# Altium schematic sheet HV_Detect.SchDoc
size A
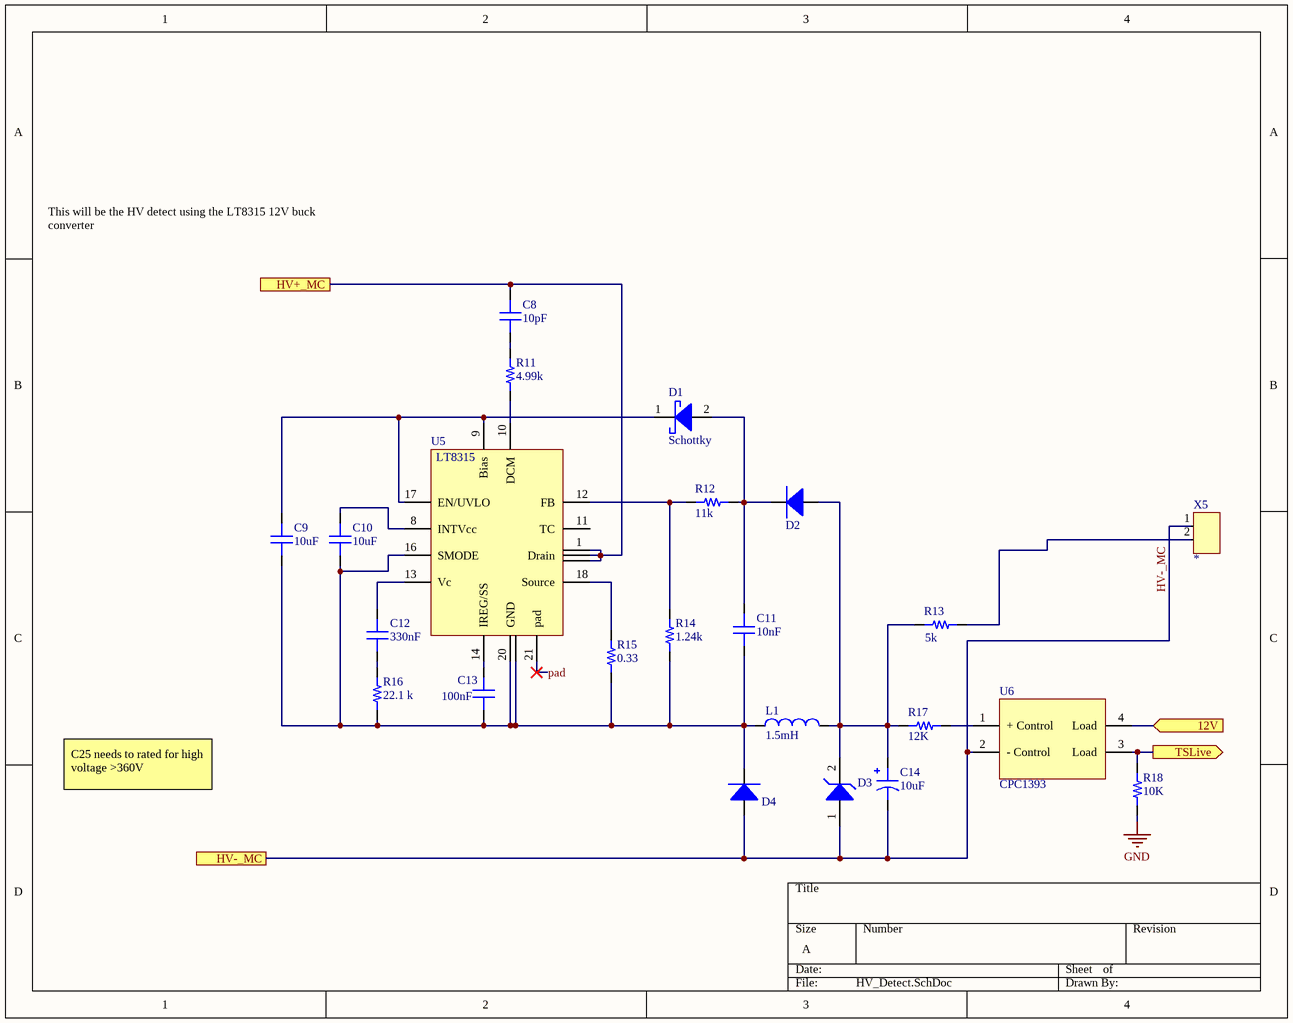
[diagram p0: HV_Detect.SchDoc]

## Parts
C8  capacitance: 10pF  [CAP 0805/2012]
C9  capacitance: 10uF  [0603]  (hidden comment: capacitor)
C10  capacitance: 10uF  [0603]  (hidden comment: capacitor)
C11  capacitance: 10nF  [0603]  (hidden comment: capacitor)
C12  capacitance: 330nF  [0603]  (hidden comment: capacitor)
C13  capacitance: 100nF  [0603]  (hidden comment: capacitor)
C14  capacitance: 10uF  [CMMR1U-06]  (hidden comment: Capacitor_Electrolytic)
D1  Schottky  [SOD323]
D2  diode  [CMMR1U-06]  (value not drawn)
D3  *  [SOD123F]  (value not drawn)
D4  diode  [C3D1P7060Q]  (value not drawn)
L1  1.5mH  [SDR1005]
R11  4.99k  [RES 0603/1608]
R12  11k  [RES 0603/1608]
R13  5k  [RES 0603/1608]
R14  1.24k  [RES 0603/1608]
R15  0.33  [RES 0603/1608]
R16  22.1 k  [RES 0603/1608]
R17  12K  [RES 0603/1608]
R18  10K  [RES 0603/1608]
U5  LT8315  [TSSOP20-Thermal]
U6  CPC1393  [CPC1393GR]
X5  *  [CONN 43650-0200 MOLEX 2PIN]

## Ports
12V (in), HV+_MC, HV-_MC, TSLive (out)

## Nets
GND: R18.1
12V: U6.4(Load) ; port 12V
HV+_MC: C8.2 U5.1(Drain) U5.2(Drain) U5.3(Drain) ; port HV+_MC
HV-_MC: C14.2 D3.1(A) D4.2 U6.2(-_Control) X5.1 ; port HV-_MC
pad: U5.21(pad)
TSLive: R18.2 U6.3(Load) ; port TSLive
NetC8_1: C8.1 R11.1
NetC9_1: C9.1 D1.1(K) U5.9(Bias) U5.17(EN/UVLO)
NetC9_2: C9.2 C10.2 C11.1 C13.1 D4.1 L1.1 R14.1 R15.1 R16.2 U5.15(GND) U5.16(SMODE) U5.20(GND)
NetC10_1: C10.1 U5.8(INTVcc)
NetC11_2: C11.2 D1.2(A) D2.1 R12.2
NetC12_1: C12.1 R16.1
NetC12_2: C12.2 U5.13(Vc)
NetC13_2: C13.2 U5.14(IREG/SS)
NetC14_1: C14.1 D2.2 D3.2(K) L1.2 R13.1 R17.1
NetR11_2: R11.2 U5.10(DCM)
NetR12_1: R12.1 R14.2 U5.12(FB)
NetR13_2: R13.2 X5.2
NetR15_2: R15.2 U5.18(Source)
NetR17_2: R17.2 U6.1(+_Control)

Not connected (* = marked no-connect by the designer): U5 11(TC)

## Notes on the sheet
- This will be the HV detect using the LT8315 12V buck converter
- C25 needs to rated for high voltage >360V

## Library data of the parts
C8 = 9: 10pF 500V Ceramic 0805; id: 9; name: CC0805JRNPOBBN100; voltage: 500; percent tolerance: 5; updatedby: Eric Tse; dielectric: Ceramic; quantity: 1; link: https://www.digikey.com/product-detail/en/yageo/CC0805JRNPOBBN100/311-4254-1-ND/8025343; createdby: Eric Tse; createddate: 12/15/2019 9:33:53 PM; updateddate: 12/15/2019 9:33:53 PM
C9-C13 = 1: Generic 0603 capacitor; id: 1; voltage: 50; dielectric: Ceramic; percent tolerance: 10; name: 0603 Capacitor; ESR: 1; package: 0603; quantity: 0
C14 = 10: 10µF 400V Aluminum Electrolytic Capacitors Ra; id: 10; name: ULV2G100MNL1GS; voltage: 400; percent tolerance: 20; ESR: 0; package: SMD Can; quantity: 0; link: https://www.digikey.com/product-detail/en/nichicon/ULV2G100MNL1GS/493-6741-1-ND/3664308
D1 = 27: 30V 200mA schottky diode; id: 27; name: CMDSH2-3; vr: 30; numcircuits: 1; updatedby: Eric Tse; quantity: 1; createdby: Eric Tse; createddate: 11/20/2019 6:50:55 PM; updateddate: 11/20/2019 6:50:55 PM
D2 = 28: Diode Standard 600V 1A Surface Mount SOD-123F; id: 28; vr: 600; numcircuits: 1; name: CMMR1U-06; package: SOD-123F; quantity: 0; link: https://www.digikey.com/product-detail/en/central-semiconductor-corp/CMMR1U-06-TR-PBFREE/1514-CMMR1U-06TRPBFREECT-ND/4807015
D3 = 10: Zener Diode 14V 500mW ±5% Surface Mount SOD-1; id: 10; name: DDZ9701; MfrPartNo: *; package: SOD-123; quantity: 0; link: https://www.digikey.com/product-detail/en/diodes-incorporated/DDZ9701-7/DDZ9701-7DICT-ND/3877402
D4 = 29: Diode Silicon Carbide Schottky 600V 9.7A (DC); id: 29; vr: 600; numcircuits: 1; name: C3D1P7060Q; package: QFN; quantity: 0; link: https://www.digikey.com/product-detail/en/cree-wolfspeed/C3D1P7060Q/C3D1P7060QCT-ND/3586865
L1 = 11: 1.5mH inductor; id: 11; imax: 0.25; tolerance: 10; resistance: 6.3; updatedby: Marc Wong; name: SDR1005; inductance: 1.5mH; package: SDR1005; quantity: 1; link: https://www.digikey.com/product-detail/en/bourns-inc/SDR1005-152KL/SDR1005-152KLCT-ND/2127182; createdby: Marc Wong; createddate: 11/22/2019 11:10:33 PM; updateddate: 11/22/2019 11:10:33 PM
R11-R18 = 1: id: 1; name: 0603 Resistor; percent tolerance: 5; package: 0603; quantity: 0
  R11: resistance: 4.99k
  R12: resistance: 11k
  R13: resistance: 5k
  R14: resistance: 1.24k
  R15: resistance: 0.33
  R16: resistance: 22.1 k
  R17: resistance: 12K
  R18: resistance: 10K
U5 = 19: 560Vin - 12Vout Buck Converter; id: 19; imax: 0.119999997317791; updatedby: Eric Tse; name: LT8315; quantity: 1; link: https://www.digikey.com/en/product-highlight/l/linear-tech/lt8315-isolated-flyback-converter; createdby: Eric Tse; createddate: 11/20/2019 18:54:34; updateddate: 11/20/2019 18:54:34
U6 = 26: Solid State Relay SPST-NO (1 Form A) 4-SMD (0.300", 7.62mm); Manufacturer_id: 1; MfrPartNo: CPC1393GRTR; idIC_Misc: 26; Value: Null; Created_By: Lynette; Drawer_id: 1; Name: CPC1393; Type: Null; Protocol: Null; Num_Circuits: 1; Data_Rate: Null; Vin(Min): Null; Vin(Max): Null; Package: CPC1393GR; Link: https://www.digikey.com/product-detail/en/ixys-integrated-circuits-division/CPC1393GRTR/CLA270CT-ND/1277144; ComponentLink1Description: Null; ComponentLink1URL: Null; Supplier1: Null; Supplier1PartNo: Null; Updated_By: Null
X5 = 9: Molex 43650_0200; id: 9; name: 0436500200; numcontacts: 2; numrows: 1; pitch: 3 mm; MfrPartNo: *; quantity: 0; link: https://www.digikey.com/product-detail/en/molex-llc/0436500200/WM1860-ND/268989